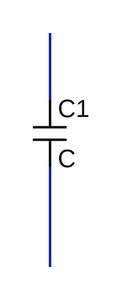
[diagram p0: schematic Draft1.asc]
Draft1.asc, the LTspice schematic file:
Version 4
SHEET 1 880 680
WIRE 112 128 112 64
WIRE 112 288 112 192
SYMBOL cap 96 128 R0
SYMATTR InstName C1

The netlist it stands for:
* Draft1.asc
C1 N001 N002 C
.backanno
.end